# Altium project QAM16.PrjPcb (part 2 of 3)

## Sheet DAC.SchDoc
size A4; Organization: Rotronic AG; Address1: Grindelstrasse 6; Address2: 8303 Bassersdorf; Address3: Switzerland; DocumentNumber: 8; SheetNumber: 8; SheetTotal: 10; Web_Address: www.rotronic.ch; E_Mail_Address: *@rotronic.ch; Fon: +41 (0)44 838 11 11; Fax: +41 (0)44 836 44 24
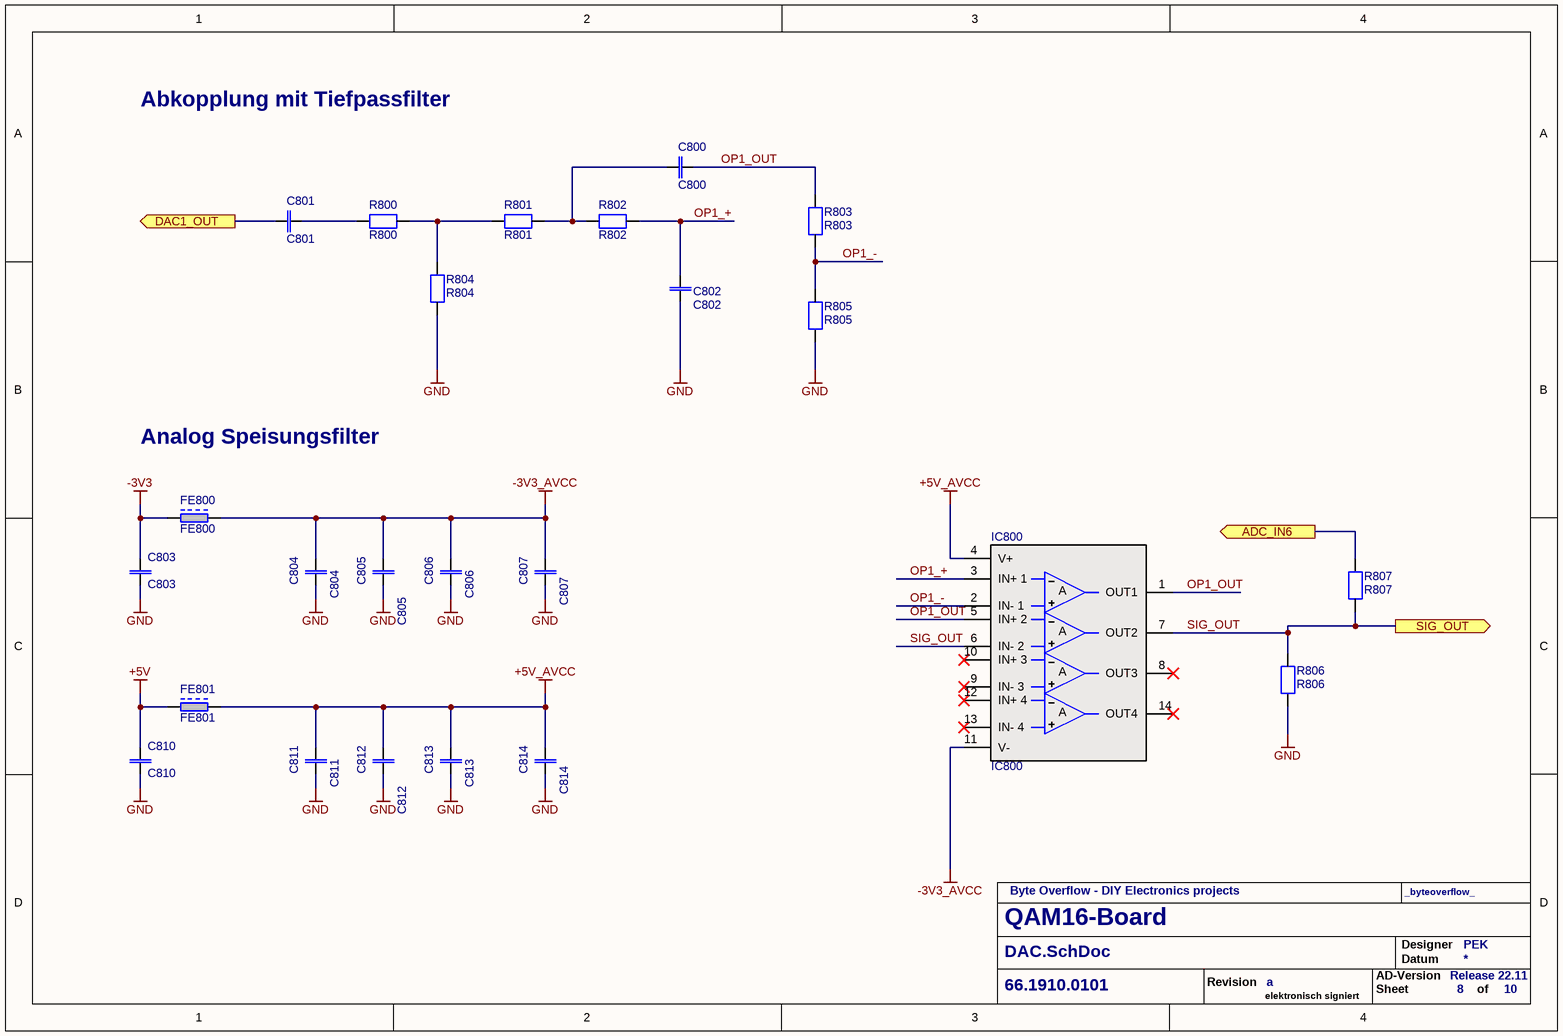
[diagram p5: DAC.SchDoc]

### Parts
C800  C800  [0603-1608]
C801  C801  [0805-2012]
C802  C802  [0603-1608]
C803  C803  [0402-1005]
C804  C804  [0805-2012]
C805  C805  [0603-1608]
C806  C806  [0805-2012]
C807  C807  [0603-1608]
C810  C810  [0402-1005]
C811  C811  [0805-2012]
C812  C812  [0603-1608]
C813  C813  [0805-2012]
C814  C814  [0603-1608]
FE800  FE800  [0603-1608]
FE801  FE801  [0603-1608]
IC800  IC800  [SOIC-14]
R800  R800  [0603-1608]
R801  R801  [0603-1608]
R802  R802  [0603-1608]
R803  R803  [0603-1608]
R804  R804  [0603-1608]
R805  R805  [0603-1608]
R806  R806  [0603-1608]
R807  R807  [0603-1608]

### Ports
ADC_IN6 (out), DAC1_OUT (out), SIG_OUT (out)

### Nets
+5V: C810.1 FE801.2
+5V_AVCC: C811.1 C812.1 C813.1 C814.1 FE801.1 IC800.4(V+)
-3V3: C803.1 FE800.2
-3V3_AVCC: C804.1 C805.1 C806.1 C807.1 FE800.1 IC800.11(V-)
GND: C802.1 C803.2 C804.2 C805.2 C806.2 C807.2 C810.2 C811.2 C812.2 C813.2 C814.2 R804.2 R805.1 R806.1
ADC_IN6: R807.1 ; port ADC_IN6
DAC1_OUT: C801.1 ; port DAC1_OUT
OP1_+: C802.2 IC800.3(IN+_1) R802.2
OP1_-: IC800.2(IN-_1) R803.2 R805.2
OP1_OUT: C800.2 IC800.1(OUT1) IC800.5(IN+_2) R803.1
SIG_OUT: IC800.6(IN-_2) IC800.7(OUT2) R806.2 R807.2 ; port SIG_OUT
NetC800_1: C800.1 R801.2 R802.1
NetC801_2: C801.2 R800.1
NetR800_2: R800.2 R801.1 R804.1

Not connected (* = marked no-connect by the designer): IC800 8(OUT3)* 9(IN-_3)* 10(IN+_3)* 12(IN+_4)* 13(IN-_4)* 14(OUT4)*

### Notes on the sheet
- Abkopplung mit Tiefpassfilter
- Analog Speisungsfilter
- Byte Overflow - DIY Electronics projects
- _byteoverflow_
- Revision
- AD-Version
- Designer
- Datum
- elektronisch signiert
- Sheet
- of
- (in symbol I0016) A

### Library data of the parts
C800 C802 = F0058: Capacitor; Part-Number: 63.0224.1400; Manufacturer: KEMET; Manufacturer Part Number: C0603C224K4RAC7867; Designator: C 220nF 16V; ID: F0058; Operating Range: -55°C to +85°C; Note: 220nF X5R 16V 10% Taiyo Yuden EMK107BJ224KAHT; Specification: 19.09.2011 MLP; Verification: 05.07.2012 OPT; Value: 220nF 16V; Component Type: Standard; ComponentLink1Description: http://www.kemet.com/docfinder?Partnumber=C0603C224K4RACTU; ComponentLink1URL: http://www.kemet.com/docfinder?Partnumber=C0603C224K4RACTU; Status: Active; Availability Date: 15.11.2016 OPT; RoHS compliant: Yes; Flammability: n.a.; Pin Count: 2; Price 100: 0.02; Price 1000: 0.02; Price Date: 02.12.2019 Pro Alpha; Changed: 19.09.2011 MLP; Price: 0.02; Supplier 1: Digi-Key; Supplier Part Number 1: 399-5619-1-ND; Part Status: Active; RoHS: RoHS Compliant
C801 C804 C806 C811 C813 = F0127: Capacitor; Part-Number: 63.0105.1500; Manufacturer: Murata Electronics North America; Manufacturer Part Number: GRM21BF51H105ZA12L; ID: F0127; Operating Range: -30°C to +85°C; Note: 1uF 50V Y5V 20% Murata GRM21BF51H105ZA12L; Specification: 27.12.2012 OPT; Value: 1uF 50V; Designator: C 1uF 50V; Component Type: Standard; Status: Active; Availability Date: 15.11.2016 OPT; RoHS compliant: Yes; Flammability: n.a.; Pin Count: 2; Price 100: 0.067; Price 1000: 0.067; Price Date: 02.12.2019 Pro Alpha; Changed: 27.12.2012 OPT; Price: 0.118; Supplier 1: Digi-Key; Supplier Part Number 1: 490-3903-1-ND; Part Status: Discontinued at Digi-Key; RoHS: RoHS Compliant; ComponentLink1Description: Datasheet; ComponentLink1URL: http://www.murata.com/products/catalog/pdf/c02e.pdf; ComponentLink2Description: http://search.murata.co.jp/Ceramy/image/img/A01X/G101/ENG/GRM21BF51H105ZA12-01.pdf; ComponentLink2URL: http://search.murata.co.jp/Ceramy/image/img/A01X/G101/ENG/GRM21BF51H105ZA12-01.pdf
C803 C810 = F0092: Capacitor; Part-Number: 63.7000.0030; Manufacturer: Taiyo Yuden; Manufacturer Part Number: JMK105BBJ475MV-F; Designator: C 4.7uF 6.3V; ID: F0092; Operating Range: -55°C to +85°C; Note: 4.7uF X5R 6.3V 20% Taiyo Yuden JMK105BBJ475MV-F; Specification: 19.09.2011 MLP; Verification: 05.07.2012 OPT; Value: 4.7uF 6.3V; Component Type: Standard; ComponentLink1Description: http://ds.yuden.co.jp/TYCOMPAS/ut/detail.do?productNo=JMK105BBJ475MV-F&fileName=JMK105BBJ475MV-F_SS&mode=specSheetDownload; ComponentLink1URL: http://ds.yuden.co.jp/TYCOMPAS/ut/detail.do?productNo=JMK105BBJ475MV-F&fileName=JMK105BBJ475MV-F_SS&mode=specSheetDownload; Status: Active; Availability Date: 15.11.2016 OPT; RoHS compliant: Yes; Flammability: n.a.; Pin Count: 2; Price 100: 0.057; Price 1000: 0.057; Price Date: 02.12.2019 Pro Alpha; Changed: 19.09.2011 MLP; Price: 0.012; Supplier Part Number 1: 587-2787-1-ND; Part Status: Active; RoHS: RoHS Compliant; Supplier 1: Digi-Key
C805 C807 C812 C814 = F0161: Capacitor; Part-Number: 63.0104.1450; Manufacturer: KEMET; Manufacturer Part Number: C0603C104K5RACTU; ID: F0161; Operating Range: -55°C to +125°C; Note: 100nF 50V X7R 10% Kemet C0603C104K5RACTU; Specification: 05.09.2013 OPT; Value: 100nF 50V; Designator: C 100nF 50V X7R; Component Type: Standard; ComponentLink1Description: Datasheet; ComponentLink1URL: http://www.kemet.com/kemet/web/homepage/kechome.nsf/vapubfiles/KEM_C1002_X7R_SMD.pdf/$file/KEM_C1002_X7R_SMD.pdf; Pin Count: 2; Price 100: 0.007; Price 1000: 0.007; Price Date: 02.12.2019 Pro Alpha; Changed: 05.09.2013 OPT; Price: 0.01; Availability Date: 15.11.2016 OPT; Flammability: n.a.; RoHS compliant: Yes; Status: Active; Part Status: Active; RoHS: RoHS Compliant; Supplier Part Number 1: 399-5089-1-ND; Supplier 1: Digi-Key
FE800 FE801 = M0071: Ferrite; Part-Number: 69.1810.2000; Manufacturer: Murata Electronics North America; ID: M0071; Operating Range: -55°C to +125°C; Note: Murata BLM18AG102SN1D Ferrit 1000Ohm 400mA; Specification: 21.09.2016 OPT; Value: BLM18AG102SN1D; Component Type: Standard; Pin Count: 2; Price Date: 02.12.2019 Pro Alpha; Changed: 21.09.2016 OPT; Price: 0.021; ComponentLink1Description: Datasheet; ComponentLink1URL: http://search.murata.co.jp/Ceramy/image/img/PDF/ENG/L0110S0100BLM18A.pdf; Price 100: 0.035; Price 1000: 0.026; Availability Date: 21.09.2016 OPT; Flammability: n.a.; RoHS compliant: Yes; Status: Active; Manufacturer Part Number: BLM18AG102SN1D; Part Status: Active; RoHS: RoHS Compliant; Supplier Part Number 1: 490-1015-1-ND; Supplier 1: Digi-Key; Designator: BLM18AG102SN1D
IC800 = I0016: OPAMP; Part-Number: 00.0000.0000; Manufacturer: Texas Instruments; Designator: LMC6484IMX/NOPB; ID: I0016; Operating Range: -40°C to +125°C; Note: Operationsverstärker CMOS QUAD Rail to Rail; Changed: 19.09.2020 PEK; Value: LMC6484IMX/NOPB; Component Type: Standard; ComponentLink1Description: Datasheet; ComponentLink1URL: https://www.ti.com/lit/ds/symlink/lmc6484.pdf?ts=1600470487572&ref_url=https%253A%252F%252Fwww.ti.com%252Fstore%252Fti%252Fen%252Fp%252Fproduct%252F%253Fp%253DLMC6484IMX%252FNOPB; Status: Active; Availability Date: 19.09.2020 PEK; RoHS compliant: Yes; Flammability: n.a.; Pin Count: 14; Price 100: 1.52; Price 1000: 1.03; Price Date: 19.09.2020 PEK; Specification: 19.09.2020 PEK; Price: 2.25; Supplier 1: Mouser; Supplier Part Number 1: LMC6484IMX/NOPB; Manufacturer Part Number: LMC6484IMX/NOPB; Part Status: Active; RoHS: RoHS Compliant
R800 = Q0174: Resistor; Part-Number: 71.5602.1300; Manufacturer: Vishay Dale; Manufacturer Part Number: CRCW060356K0FKEA; Designator: R 56k 1%; ID: Q0174; Note: 56k 1% 100ppm 1/10W Vishay CRCW060356K0FKEA; Changed: 19.09.2011 MLP; Verification: 05.07.2012 OPT; Value: 56k 1%; Component Type: Standard; ComponentLink1Description: http://www.vishay.com/docs/20035/dcrcwe3.pdf; ComponentLink1URL: http://www.vishay.com/docs/20035/dcrcwe3.pdf; Operating Range: -; Status: Active; Availability Date: 16.11.2016 OPT; RoHS compliant: Yes; Flammability: n.a.; Pin Count: 2; Price 100: 0.002; Price 1000: 0.002; Price Date: 02.12.2019 Pro Alpha; Specification: 19.09.2011 MLP; Price: 0.002; Supplier: Digi-Key; Supplier Part Number: 541-56.0KHCT-ND; Part Status: Active; RoHS: RoHS Compliant
R801 R802 R805-R807 = Q0017: Resistor; Part-Number: 71.1002.1300; Manufacturer: Vishay Dale; Manufacturer Part Number: CRCW060310K0FKEAHP; Designator: R 10k 1%; ID: Q0017; Operating Range: -55°C to +155°C; Note: 10k 1% 100ppm 1/10W Vishay CRCW060310K0FKEA; Changed: 19.09.2011 MLP; Verification: 05.07.2012 OPT; Value: 10k; Component Type: Standard; ComponentLink1Description: http://www.vishay.com/docs/20043/crcwhpe3.pdf; ComponentLink1URL: http://www.vishay.com/docs/20043/crcwhpe3.pdf; Status: Active; Availability Date: 16.11.2016 OPT; RoHS compliant: Yes; Flammability: n.a.; Pin Count: 2; Price 100: 0.002; Price 1000: 0.002; Price Date: 02.12.2019 Pro Alpha; Specification: 19.09.2011 MLP; Price: 0.001; Supplier: Digi-Key; Supplier Part Number: 541-10.0KSCT-ND; Part Status: Active; RoHS: RoHS Compliant
R803 = Q0180: Resistor; Part-Number: 71.6801.1300; Manufacturer: Vishay Dale; Manufacturer Part Number: CRCW06036K80FKEA; Designator: R 6.8k 1%; ID: Q0180; Operating Range: -55°C to +155°C; Note: 6.8k 1% 100ppm 1/10W Vishay CRCW06036K80FKEA; Changed: 19.09.2011 MLP; Verification: 05.07.2012 OPT; Value: 6.8k 1%; Component Type: Standard; ComponentLink1Description: http://www.vishay.com/docs/20035/dcrcwe3.pdf; ComponentLink1URL: http://www.vishay.com/docs/20035/dcrcwe3.pdf; Status: Active; Availability Date: 16.11.2016 OPT; RoHS compliant: Yes; Flammability: n.a.; Pin Count: 2; Price 100: 0.002; Price 1000: 0.002; Price Date: 02.12.2019 Pro Alpha; Specification: 19.09.2011 MLP; Price: 0.002; Supplier: Digi-Key; Supplier Part Number: 541-6.80KHCT-ND; Part Status: Active; RoHS: RoHS Compliant
R804 = Q0073: Resistor; Part-Number: 71.1802.1300; Manufacturer: Vishay Dale; Manufacturer Part Number: CRCW060318K0FKEA; Designator: R 18k 1%; ID: Q0073; Operating Range: -55°C to +155°C; Note: 18k 1% 100ppm 1/10W Vishay CRCW060318K0FKTA; Changed: 19.09.2011 MLP; Verification: 05.07.2012 OPT; Value: 18k 1%; Component Type: Standard; ComponentLink1Description: http://www.vishay.com/docs/20035/dcrcwe3.pdf; ComponentLink1URL: http://www.vishay.com/docs/20035/dcrcwe3.pdf; Status: Active; Availability Date: 16.11.2016 OPT; RoHS compliant: Yes; Flammability: n.a.; Pin Count: 2; Price 100: 0.002; Price 1000: 0.002; Price Date: 02.12.2019 Pro Alpha; Specification: 19.09.2011 MLP; Price: 0.002; Supplier: Digi-Key; Supplier Part Number: 541-18.0KHDKR-ND; Part Status: Active; RoHS: RoHS Compliant

## Sheet Display.SchDoc
size A4; Organization: Rotronic AG; Address1: Grindelstrasse 6; Address2: 8303 Bassersdorf; Address3: Switzerland; DocumentNumber: 4; SheetNumber: 4; SheetTotal: 10; Web_Address: www.rotronic.ch; E_Mail_Address: *@rotronic.ch; Fon: +41 (0)44 838 11 11; Fax: +41 (0)44 836 44 24
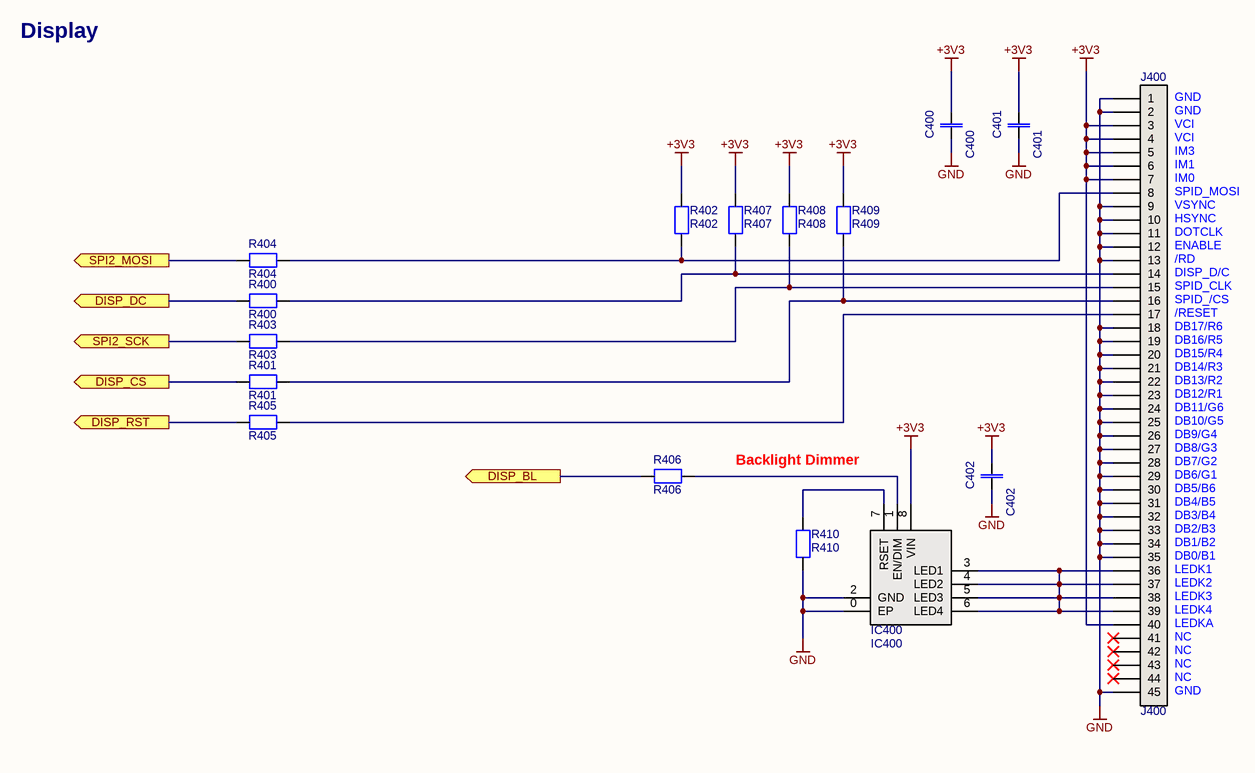
[diagram p6: Display.SchDoc]

### Parts
C400  C400  [0805-2012]
C401  C401  [0603-1608]
C402  C402  [0603-1608]
IC400  IC400  [UDFN-8 517AW-01]
J400  J400  [SAMTEC_ZF5S-45-01-T-WT]
R400  R400  [0603-1608]
R401  R401  [0603-1608]
R402  R402  [0603-1608]
R403  R403  [0603-1608]
R404  R404  [0603-1608]
R405  R405  [0603-1608]
R406  R406  [0603-1608]
R407  R407  [0603-1608]
R408  R408  [0603-1608]
R409  R409  [0603-1608]
R410  R410  [0603-1608]

### Ports
DISP_BL (out), DISP_CS (out), DISP_DC (out), DISP_RST (out), SPI2_MOSI (out), SPI2_SCK (out)

### Nets
+3V3: C400.1 C401.1 C402.1 IC400.8(VIN) J400.3 J400.4 J400.5 J400.6 J400.7 J400.40 R402.2 R407.2 R408.2 R409.2
GND: C400.2 C401.2 C402.2 IC400.0(EP) IC400.2(GND) J400.1 J400.2 J400.9 J400.10 J400.11 J400.12 J400.13 J400.18 J400.19 J400.20 J400.21 J400.22 J400.23 J400.24 J400.25 J400.26 J400.27 J400.28 J400.29 J400.30 J400.31 J400.32 J400.33 J400.34 J400.35 J400.45 R410.2
DISP_BL: R406.2 ; port DISP_BL
DISP_CS: R401.2 ; port DISP_CS
DISP_DC: R400.2 ; port DISP_DC
DISP_RST: R405.2 ; port DISP_RST
SPI2_MOSI: R404.2 ; port SPI2_MOSI
SPI2_SCK: R403.2 ; port SPI2_SCK
NetIC400_1: IC400.1(EN/DIM) R406.1
NetIC400_3: IC400.3(LED1) IC400.4(LED2) IC400.5(LED3) IC400.6(LED4) J400.36 J400.37 J400.38 J400.39
NetIC400_7: IC400.7(RSET) R410.1
NetJ400_8: J400.8 R402.1 R404.1
NetJ400_14: J400.14 R400.1 R407.1
NetJ400_15: J400.15 R403.1 R408.1
NetJ400_16: J400.16 R401.1 R409.1
NetJ400_17: J400.17 R405.1

Not connected (* = marked no-connect by the designer): J400 41* 42* 43* 44*

### Notes on the sheet
- Display
- (near J400) GND
- (near J400) VCI
- (near J400) IM3
- (near J400) IM1
- (near J400) IM0
- (near J400) SPID_MOSI
- (near J400) VSYNC
- (near J400) HSYNC
- (near J400) DOTCLK
- (near J400) ENABLE
- (near J400) /RD
- (near J400) DISP_D/C
- (near J400) /RESET
- (near J400) SPID_/CS
- (near J400) SPID_CLK
- (near J400) DB17/R6
- (near J400) DB16/R5
- (near J400) DB15/R4
- (near J400) DB14/R3
- (near J400) DB13/R2
- (near J400) DB12/R1
- (near J400) DB11/G6
- (near J400) DB8/G3
- (near J400) DB9/G4
- (near J400) DB10/G5
- Backlight Dimmer
- (near J400) DB4/B5
- (near J400) DB5/B6
- (near J400) DB6/G1
- (near J400) DB7/G2
- (near J400) DB0/B1
- (near J400) DB1/B2
- (near J400) DB2/B3
- (near J400) DB3/B4
- (near J400) LEDK1
- (near J400) LEDK2
- (near J400) LEDK3
- (near J400) LEDK4
- (near J400) LEDKA
- (near J400) NC
- Byte Overflow - DIY Electronics projects
- _byteoverflow_
- Revision
- AD-Version
- Designer
- Datum
- elektronisch signiert
- Sheet
- of

### Library data of the parts
C400 = F0127: Capacitor; Part-Number: 63.0105.1500; Manufacturer: Murata Electronics North America; Manufacturer Part Number: GRM21BF51H105ZA12L; Designator: C 1uF 50V; ID: F0127; Operating Range: -30°C to +85°C; Note: 1uF 50V Y5V 20% Murata GRM21BF51H105ZA12L; Specification: 27.12.2012 OPT; Value: 1uF 50V; Component Type: Standard; ComponentLink1Description: Datasheet; ComponentLink1URL: http://www.murata.com/products/catalog/pdf/c02e.pdf; Status: Active; Availability Date: 15.11.2016 OPT; RoHS compliant: Yes; Flammability: n.a.; ComponentLink2Description: http://search.murata.co.jp/Ceramy/image/img/A01X/G101/ENG/GRM21BF51H105ZA12-01.pdf; ComponentLink2URL: http://search.murata.co.jp/Ceramy/image/img/A01X/G101/ENG/GRM21BF51H105ZA12-01.pdf; Pin Count: 2; Price 100: 0.067; Price 1000: 0.067; Price Date: 02.12.2019 Pro Alpha; Changed: 27.12.2012 OPT; Price: 0.118; Supplier Part Number 1: 490-3903-1-ND; Part Status: Discontinued at Digi-Key; RoHS: RoHS Compliant; Supplier 1: Digi-Key
C401 C402 = F0161: as C805 on sheet DAC; Component Type: Standard; ComponentLink1Description: Datasheet; ComponentLink1URL: http://www.kemet.com/kemet/web/homepage/kechome.nsf/vapubfiles/KEM_C1002_X7R_SMD.pdf/$file/KEM_C1002_X7R_SMD.pdf; Status: Active; Availability Date: 15.11.2016 OPT; RoHS compliant: Yes; Flammability: n.a.; Pin Count: 2; Price 100: 0.007; Price 1000: 0.007; Price Date: 02.12.2019 Pro Alpha; Changed: 05.09.2013 OPT; Price: 0.01; Supplier Part Number 1: 399-5089-1-ND; Part Status: Active; RoHS: RoHS Compliant; Supplier 1: Digi-Key
IC400 = E0058: Driver; Part-Number: 61.4004.2300; Manufacturer: ON Semiconductor; Designator: CAT4004AHU2-GT3; ID: E0058; Operating Range: -40°C to +125°C; Note: ON Semiconductor CAT4004AHU2-GT3 LED-Beleuchtungstreiber LED DR 4 CH EZ DIM I/F; Specification: 13.09.2013 OPT; Verification: 18.09.2014 FUW; Value: CAT4004AHU2-GT3; Component Type: Standard; ComponentLink1Description: Datasheet; ComponentLink1URL: http://www.onsemi.com/pub_link/Collateral/CAT4004A-D.PDF; Status: Active; Availability Date: 15.11.2016 OPT; RoHS compliant: Yes; Flammability: n.a.; Pin Count: 8; Price 100: 0.624; Price 1000: 0.436; Price Date: 02.12.2019 Pro Alpha; Changed: 13.09.2013 OPT; Price: 0.591; Supplier Part Number 1: CAT4004AHU2-GT3OSCT-ND; Manufacturer Part Number: CAT4004AHU2-GT3; Part Status: Active; RoHS: RoHS Compliant; Supplier 1: Digi-Key
J400 = N0180: Connector; Part-Number: 00.0000.0000; Designator: FFC 45 Pos F32Q-1A7H1-11045; ID: N0180; Operating Range: -40°C to +120°C; Note: FFC & FPC-Steckverbinder F31W-1A7H1-11024-Slider type; Specification: 02.04.2022 PEK; Value: FFC 45 Pos F32Q-1A7H1-11045; Component Type: Standard; ComponentLink1Description: Datasheet; ComponentLink1URL: https://cdn.amphenol-cs.com/media/wysiwyg/files/documentation/datasheet/flex/ffc_fpc_050mm_f32r_f32q.pdf; Status: Active; Availability Date: 02.04.2022 PEK; RoHS compliant: Yes; Flammability: UL 94 V-0; Pin Count: 45; Price 100: 1.11; Price 1000: 1.11; Price Date: 02.04.2022 PEK; Changed: 02.04.2022 PEK; Price: 1.11
R400 R401 R403-R406 = Q0011: Resistor; Part-Number: 71.1000.1300; Manufacturer: Vishay Dale; Manufacturer Part Number: CRCW0603100RFKEA; Designator: R 100E 1%; ID: Q0011; Operating Range: -55°C to +155°C; Note: 100E 1% 100ppm 1/10W Vishay / Dale CRCW0603100RFKTB; Changed: 19.09.2011 MLP; Verification: 05.07.2012 OPT; Value: 100E 1%; Component Type: Standard; ComponentLink1Description: http://www.vishay.com/docs/20035/dcrcwe3.pdf; ComponentLink1URL: http://www.vishay.com/docs/20035/dcrcwe3.pdf; Status: Active; Availability Date: 16.11.2016 OPT; RoHS compliant: Yes; Flammability: n.a.; Pin Count: 2; Price 100: 0.002; Price 1000: 0.002; Price Date: 02.12.2019 Pro Alpha; Specification: 19.09.2011 MLP; Price: 0.002; Supplier: Digi-Key; Supplier Part Number: 541-100HCT-ND; Part Status: Active; RoHS: RoHS Compliant
R402 R407-R409 = Q0017: Resistor; Part-Number: 71.1002.1300; Manufacturer: Vishay Dale; Manufacturer Part Number: CRCW060310K0FKEAHP; ID: Q0017; Operating Range: -55°C to +155°C; Note: 10k 1% 100ppm 1/10W Vishay CRCW060310K0FKEA; Changed: 19.09.2011 MLP; Verification: 05.07.2012 OPT; Value: 10k; Designator: R 10k 1%; Component Type: Standard; ComponentLink1Description: http://www.vishay.com/docs/20043/crcwhpe3.pdf; ComponentLink1URL: http://www.vishay.com/docs/20043/crcwhpe3.pdf; Status: Active; Availability Date: 16.11.2016 OPT; RoHS compliant: Yes; Flammability: n.a.; Pin Count: 2; Price 100: 0.002; Price 1000: 0.002; Price Date: 02.12.2019 Pro Alpha; Specification: 19.09.2011 MLP; Price: 0.001; Supplier: Digi-Key; Supplier Part Number: 541-10.0KSCT-ND; Part Status: Active; RoHS: RoHS Compliant
R410 = Q0140: Resistor; Part-Number: 71.3901.1300; Manufacturer: Vishay Dale; Manufacturer Part Number: CRCW06033K90FKEA; Designator: R 3.9k 1%; ID: Q0140; Note: 3.9k 1% 100ppm 1/10W Vishay CRCW06033K90FKEA; Changed: 19.09.2011 MLP; Verification: 05.07.2012 OPT; Value: 3.9k 1%; Component Type: Standard; Operating Range: -; Status: Active; Availability Date: 16.11.2016 OPT; RoHS compliant: Yes; Flammability: n.a.; Pin Count: 2; Price 100: 0.002; Price 1000: 0.002; Price Date: 02.12.2019 Pro Alpha; Specification: 19.09.2011 MLP; Price: 0.002; Supplier: Digi-Key; Supplier Part Number: 541-3.90KHCT-ND; Part Status: Active; RoHS: RoHS Compliant

## Sheet Sensors.SchDoc
size A4; Organization: Rotronic AG; Address1: Grindelstrasse 6; Address2: 8303 Bassersdorf; Address3: Switzerland; DocumentNumber: 5; SheetNumber: 5; SheetTotal: 10; Web_Address: www.rotronic.ch; E_Mail_Address: *@rotronic.ch; Fon: +41 (0)44 838 11 11; Fax: +41 (0)44 836 44 24
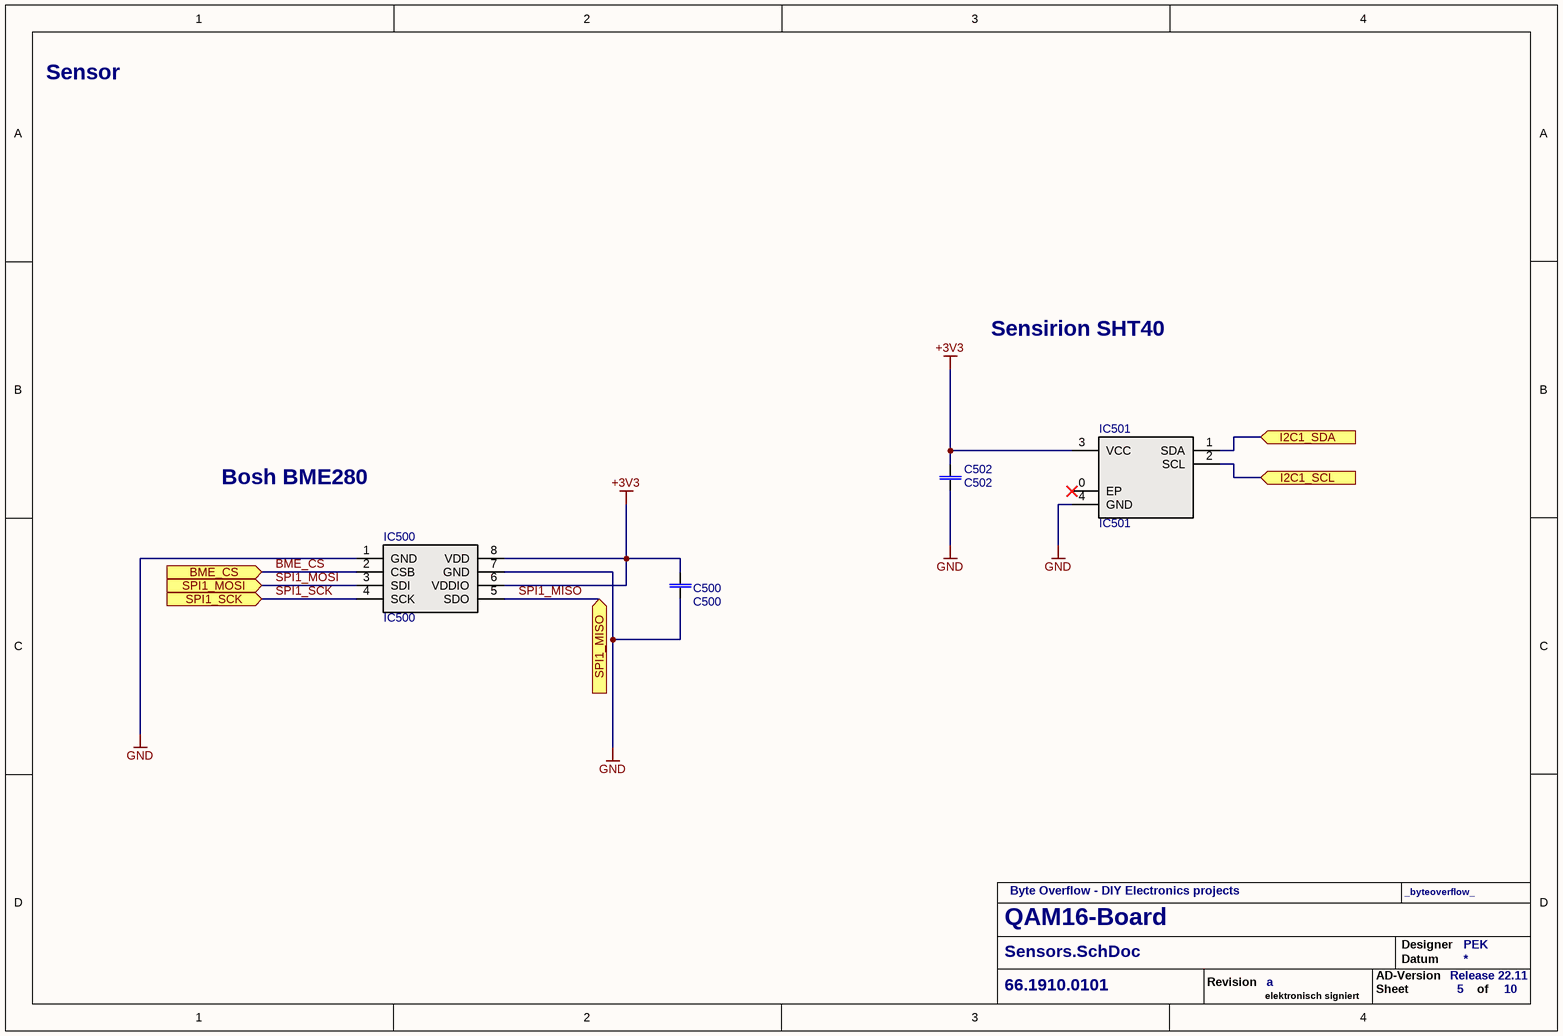
[diagram p7: Sensors.SchDoc]

### Parts
C500  C500  [0603-1608]
C502  C502  [0603-1608]
IC500  IC500  [LGA-8 2.5x2.5x0.95]
IC501  IC501  [XDCR_SHT40-AD1B-R2]

### Ports
BME_CS (in), I2C1_SCL (in), I2C1_SDA (in), SPI1_MISO (in), SPI1_MOSI (in), SPI1_SCK (in)

### Nets
+3V3: C500.1 C502.1 IC500.6(VDDIO) IC500.8(VDD) IC501.3(VCC)
GND: C500.2 C502.2 IC500.1(GND) IC500.7(GND) IC501.4(GND)
BME_CS: IC500.2(CSB) ; port BME_CS
I2C1_SCL: IC501.2(SCL) ; port I2C1_SCL
I2C1_SDA: IC501.1(SDA) ; port I2C1_SDA
SPI1_MISO: IC500.5(SDO) ; port SPI1_MISO
SPI1_MOSI: IC500.3(SDI) ; port SPI1_MOSI
SPI1_SCK: IC500.4(SCK) ; port SPI1_SCK

Not connected (* = marked no-connect by the designer): IC501 0(EP)*

### Notes on the sheet
- Sensor
- Sensirion SHT40
- Bosh BME280
- Byte Overflow - DIY Electronics projects
- _byteoverflow_
- Revision
- AD-Version
- Designer
- Datum
- elektronisch signiert
- Sheet
- of

### Library data of the parts
C500 C502 = F0161: as C805 on sheet DAC; Component Type: Standard; Status: Active; Availability Date: 15.11.2016 OPT; RoHS compliant: Yes; Flammability: n.a.; Pin Count: 2; Price 100: 0.007; Price 1000: 0.007; Price Date: 02.12.2019 Pro Alpha; Changed: 05.09.2013 OPT; Price: 0.01; Supplier 1: Digi-Key; Supplier Part Number 1: 399-5089-1-ND; Part Status: Active; RoHS: RoHS Compliant; ComponentLink1Description: Datasheet; ComponentLink1URL: http://www.kemet.com/kemet/web/homepage/kechome.nsf/vapubfiles/KEM_C1002_X7R_SMD.pdf/$file/KEM_C1002_X7R_SMD.pdf
IC500 = E0109: Sensor; Part-Number: 61.0280.0499; Manufacturer: Bosch Sensortec; Designator: BME280; ID: E0109; Operating Range: -40°C to +85°C; Note: Bosch BME280 Digital Pressure/Humidity/Temperature Sensor; Specification: 05.04.2016 ENP; Value: BME280; Component Type: Standard; ComponentLink1Description: Datasheet; ComponentLink1URL: https://ae-bst.resource.bosch.com/media/_tech/media/datasheets/BST-BME280_DS001-11.pdf; Status: Active; Availability Date: 15.11.2016 OPT; RoHS compliant: Yes; Flammability: n.a.; Pin Count: 8; Price 100: 6.18; Price 1000: 5.35; Price Date: 02.12.2019 Pro Alpha; Changed: 05.04.2016 ENP; Price: 3.595; Supplier 1: Digi-Key; Supplier Part Number 1: 828-1063-1-ND; Manufacturer Part Number: BME280; Part Status: Active; RoHS: RoHS Compliant
IC501 = E0147: Sensor; Part-Number: 00.0000.0000; Manufacturer: Sensirion; Designator: SHT40-AD1B-R2; ID: E0147; Operating Range: -40°C to +85°C; Note: Feuchtigkeitssensoren für Plattenmontage RH/ T Sensor; Specification: 02.04.2021 PEK; Value: SHT40-AD1B-R2; Component Type: Standard; ComponentLink1Description: Datasheet; ComponentLink1URL: https://www.mouser.ch/datasheet/2/682/Datasheet_SHT4xA-3002605.pdf; Status: Active; Availability Date: 02.04.2021 PEK; RoHS compliant: Yes; Flammability: n.a; Pin Count: 5; Price 100: 1.68; Price 1000: 1.33; Price Date: 02.04.2021 PEK; Changed: 02.04.2021 PEK; Price: 2.87; Supplier 1: Mouser; Supplier Part Number 1: 403-SHT40-AD1B-R2; Manufacturer Part Number: SHT40-AD1B-R2; Part Status: Active; RoHS: RoHS Compliant

## Sheet MCU.SchDoc
size A3; Organization: Rotronic AG; Address1: Grindelstrasse 6; Address2: 8303 Bassersdorf; Address3: Switzerland; DocumentNumber: 2; SheetNumber: 2; SheetTotal: 10; Web_Address: www.rotronic.ch; E_Mail_Address: *@rotronic.ch; Fon: +41 (0)44 838 11 11; Fax: +41 (0)44 836 44 24
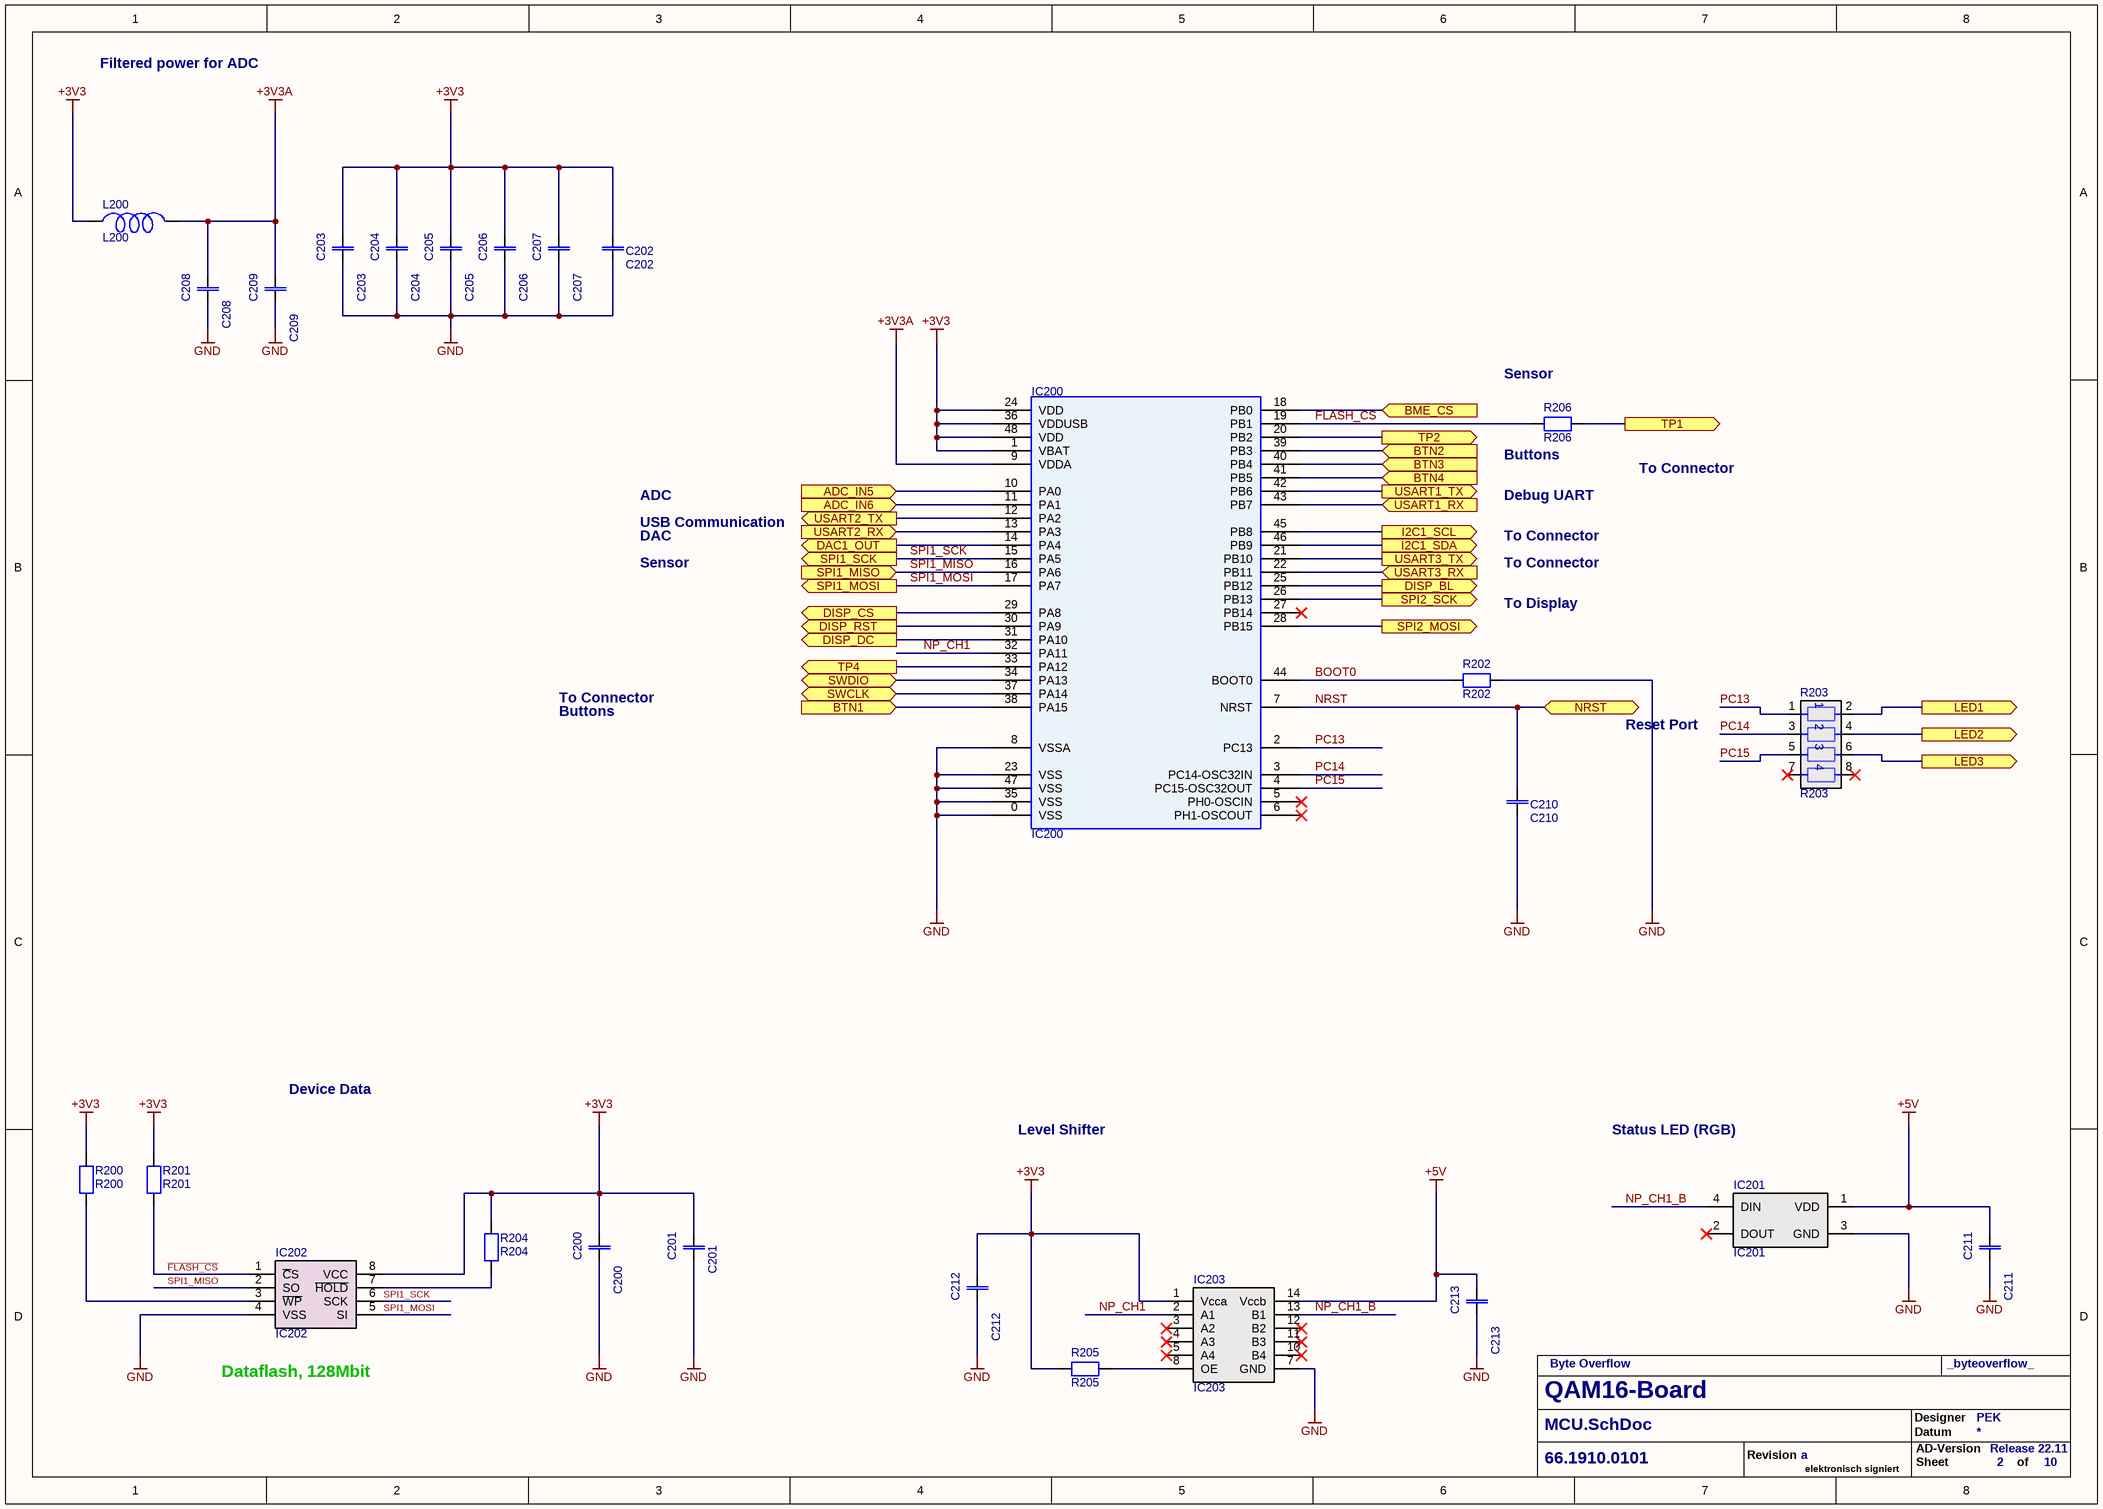
[diagram p8: MCU.SchDoc]

### Parts
C200  C200  [0603-1608]
C201  C201  [0805-2012]
C202  C202  [0603-1608]
C203  C203  [0603-1608]
C204  C204  [0603-1608]
C205  C205  [0603-1608]
C206  C206  [0603-1608]
C207  C207  [0603-1608]
C208  C208  [0805-2012]
C209  C209  [0603-1608]
C210  C210  [0603-1608]
C211  C211  [0603-1608]
C212  C212  [0603-1608]
C213  C213  [0603-1608]
IC200  IC200  [QFN48 7x7x0.9 WIZnet]
IC201  IC201  [LED_2812]
IC202  IC202  [SOIC-8]
IC203  IC203  [TSSOP14]
L200  L200  [0603-1608]
R200  R200  [0603-1608]
R201  R201  [0603-1608]
R202  R202  [0603-1608]
R203  R203  [Array-2010-4Way]
R204  R204  [0603-1608]
R205  R205  [0805-2012]
R206  R206  [0603-1608]

### Ports
ADC_IN5 (in), ADC_IN6 (in), BME_CS (in), BTN1 (in), BTN2 (in), BTN3 (in), BTN4 (in), DAC1_OUT (out), DISP_BL (out), DISP_CS (out), DISP_DC (out), DISP_RST (out), I2C1_SCL (out), I2C1_SDA (out), LED1 (out), LED2 (out), LED3 (out), NRST (bidir), SPI1_MISO (in), SPI1_MOSI (out), SPI1_SCK (out), SPI2_MOSI (out), SPI2_SCK (out), SWCLK (bidir), SWDIO (bidir), TP1 (out), TP2 (out), TP4 (out), USART1_RX (in), USART1_TX (out), USART2_RX (in), USART2_TX (out), USART3_RX (in), USART3_TX (out)

### Nets
+3V3: C200.1 C201.1 C202.1 C203.1 C204.1 C205.1 C206.1 C207.1 C212.1 IC200.1(VBAT) IC200.24(VDD) IC200.36(VDDUSB) IC200.48(VDD) IC202.8(VCC) IC203.1(Vcca) L200.1 R200.2 R201.2 R204.2 R205.1
+3V3A: C208.1 C209.1 IC200.9(VDDA) L200.2
+5V: C211.1 C213.1 IC201.1(VDD) IC203.14(Vccb)
GND: C200.2 C201.2 C202.2 C203.2 C204.2 C205.2 C206.2 C207.2 C208.2 C209.2 C210.2 C211.2 C212.2 C213.2 IC200.0(VSS) IC200.8(VSSA) IC200.23(VSS) IC200.35(VSS) IC200.47(VSS) IC201.3(GND) IC202.4(VSS) IC203.7(GND) R202.2
~{FLASH_CS}: IC200.19(PB1) IC202.1(~{C}S) R201.1 R206.1
ADC_IN5: IC200.10(PA0) ; port ADC_IN5
ADC_IN6: IC200.11(PA1) ; port ADC_IN6
BME_CS: IC200.18(PB0) ; port BME_CS
BOOT0: IC200.44(BOOT0) R202.1
BTN1: IC200.38(PA15) ; port BTN1
BTN2: IC200.39(PB3) ; port BTN2
BTN3: IC200.40(PB4) ; port BTN3
BTN4: IC200.41(PB5) ; port BTN4
DAC1_OUT: IC200.14(PA4) ; port DAC1_OUT
DISP_BL: IC200.25(PB12) ; port DISP_BL
DISP_CS: IC200.29(PA8) ; port DISP_CS
DISP_DC: IC200.31(PA10) ; port DISP_DC
DISP_RST: IC200.30(PA9) ; port DISP_RST
I2C1_SCL: IC200.45(PB8) ; port I2C1_SCL
I2C1_SDA: IC200.46(PB9) ; port I2C1_SDA
LED1: R203.2 ; port LED1
LED2: R203.4 ; port LED2
LED3: R203.6 ; port LED3
NP_CH1: IC200.32(PA11) IC203.2(A1)
NP_CH1_B: IC201.4(DIN) IC203.13(B1)
NRST: C210.1 IC200.7(NRST) ; port NRST
PC13: IC200.2(PC13) R203.1
PC14: IC200.3(PC14-OSC32IN) R203.3
PC15: IC200.4(PC15-OSC32OUT) R203.5
SPI1_MISO: IC200.16(PA6) IC202.2(SO) ; port SPI1_MISO
SPI1_MOSI: IC200.17(PA7) IC202.5(SI) ; port SPI1_MOSI
SPI1_SCK: IC200.15(PA5) IC202.6(SCK) ; port SPI1_SCK
SPI2_MOSI: IC200.28(PB15) ; port SPI2_MOSI
SPI2_SCK: IC200.26(PB13) ; port SPI2_SCK
SWCLK: IC200.37(PA14) ; port SWCLK
SWDIO: IC200.34(PA13) ; port SWDIO
TP1: R206.2 ; port TP1
TP2: IC200.20(PB2) ; port TP2
TP4: IC200.33(PA12) ; port TP4
USART1_RX: IC200.43(PB7) ; port USART1_RX
USART1_TX: IC200.42(PB6) ; port USART1_TX
USART2_RX: IC200.13(PA3) ; port USART2_RX
USART2_TX: IC200.12(PA2) ; port USART2_TX
USART3_RX: IC200.22(PB11) ; port USART3_RX
USART3_TX: IC200.21(PB10) ; port USART3_TX
NetIC202_3: IC202.3(~{WP}) R200.1
NetIC202_7: IC202.7(~{HOLD}) R204.1
NetIC203_8: IC203.8(OE) R205.2

Not connected (* = marked no-connect by the designer): IC200 5(PH0-OSCIN)* 6(PH1-OSCOUT)* 27(PB14)*; IC201 2(DOUT)*; IC203 3(A2)* 4(A3)* 5(A4)* 6(NC) 9(NC) 10(B4)* 11(B3)* 12(B2)*; R203 7* 8*

### Notes on the sheet
- Filtered power for ADC
- (near R206) Sensor
- ADC
- Debug UART
- (near R206) Buttons
- To Connector
- USB Communication
- Sensor
- DAC
- To Display
- Buttons
- Reset Port
- Device Data
- Level Shifter
- Status LED (RGB)
- (near IC202) Dataflash, 128Mbit
- Byte Overflow
- _byteoverflow_
- Revision
- Designer
- Datum
- AD-Version
- elektronisch signiert
- Sheet
- of

### Library data of the parts
C200 C210 = F0161: as C805 on sheet DAC; Component Type: Standard; ComponentLink1Description: Datasheet; ComponentLink1URL: http://www.kemet.com/kemet/web/homepage/kechome.nsf/vapubfiles/KEM_C1002_X7R_SMD.pdf/$file/KEM_C1002_X7R_SMD.pdf; Pin Count: 2; Price 100: 0.007; Price 1000: 0.007; Price Date: 02.12.2019 Pro Alpha; Changed: 05.09.2013 OPT; Price: 0.01; Availability Date: 15.11.2016 OPT; Flammability: n.a.; RoHS compliant: Yes; Status: Active; Part Status: Active; RoHS: RoHS Compliant; Supplier Part Number 1: 399-5089-1-ND; Supplier 1: Digi-Key
C201 C208 = F0127: as C801 on sheet DAC; Component Type: Standard; Pin Count: 2; Price 100: 0.067; Price 1000: 0.067; Price Date: 02.12.2019 Pro Alpha; Changed: 27.12.2012 OPT; Price: 0.118; Availability Date: 15.11.2016 OPT; Flammability: n.a.; RoHS compliant: Yes; Status: Active; ComponentLink1Description: Datasheet; ComponentLink1URL: http://www.murata.com/products/catalog/pdf/c02e.pdf; Part Status: Discontinued at Digi-Key; RoHS: RoHS Compliant; Supplier Part Number 1: 490-3903-1-ND; ComponentLink2Description: http://search.murata.co.jp/Ceramy/image/img/A01X/G101/ENG/GRM21BF51H105ZA12-01.pdf; ComponentLink2URL: http://search.murata.co.jp/Ceramy/image/img/A01X/G101/ENG/GRM21BF51H105ZA12-01.pdf; Supplier 1: Digi-Key
C202 = F0193: Capacitor; Part-Number: 63.7000.0032; Manufacturer: Murata Electronics North America; Manufacturer Part Number: GRM188R61E475ME11D; Designator: C 4.7uF 25V; ID: F0193; Operating Range: -55°C to +85°C; Note: 4.7uF 25V X5R 20% Murata Electronics GRM188R61E475ME11D; Specification: 02.09.2015 OPT; Value: 4.7uF 25V X5R; Component Type: Standard; ComponentLink1Description: Datasheet; ComponentLink1URL: http://search.murata.co.jp/Ceramy/image/img/A01X/partnumbering_e_01.pdf; Status: Active; Availability Date: 15.11.2016 OPT; RoHS compliant: Yes; Flammability: n.a.; ComponentLink2Description: http://search.murata.co.jp/Ceramy/image/img/A01X/G101/ENG/GRM188R61E475ME11-01.pdf; ComponentLink2URL: http://search.murata.co.jp/Ceramy/image/img/A01X/G101/ENG/GRM188R61E475ME11-01.pdf; Pin Count: 2; Price 100: 0.13; Price 1000: 0.11; Price Date: 02.12.2019 Pro Alpha; Changed: 02.09.2015 OPT; Price: 0.096; Supplier 1: Digi-Key; Supplier Part Number 1: GRM188R61E475ME11D-ND; Part Status: Active; RoHS: RoHS Compliant
C203-C207 C209 C211-C213 = F0161: Capacitor; Part-Number: 63.0104.1450; Manufacturer: KEMET; Manufacturer Part Number: C0603C104K5RACTU; Designator: C 100nF 50V X7R; ID: F0161; Operating Range: -55°C to +125°C; Note: 100nF 50V X7R 10% Kemet C0603C104K5RACTU; Specification: 05.09.2013 OPT; Value: 100nF 50V; Component Type: Standard; ComponentLink1Description: Datasheet; ComponentLink1URL: http://www.kemet.com/kemet/web/homepage/kechome.nsf/vapubfiles/KEM_C1002_X7R_SMD.pdf/$file/KEM_C1002_X7R_SMD.pdf; Status: Active; Availability Date: 15.11.2016 OPT; RoHS compliant: Yes; Flammability: n.a.; Pin Count: 2; Price 100: 0.007; Price 1000: 0.007; Price Date: 02.12.2019 Pro Alpha; Changed: 05.09.2013 OPT; Price: 0.01; Supplier 1: Digi-Key; Supplier Part Number 1: 399-5089-1-ND; Part Status: Active; RoHS: RoHS Compliant
IC200 = H0056: uC; Part-Number: 00.0000.0000; Manufacturer: STMicroelectronics; Designator: ST STM32L452CEU6; ID: H0056; Operating Range: -40°C to +85°C; Note: ARM Mikrocontroller - MCU STM32 Dyn Eff MCU 512 K 100 MHz CPU; Changed: 19.10.2022 PEK; Value: ST STM32L452CEU6; Component Type: Standard; ComponentLink1Description: Datasheet; ComponentLink1URL: https://www.st.com/resource/en/datasheet/stm32l452re.pdf; Status: Active; Availability Date: 19.10.2022 PEK; RoHS compliant: Yes; Flammability: n.a; Pin Count: 48; Price 100: 9.99; Price 1000: 9.99; Price Date: 19.10.2022 PEK; Specification: 19.10.2022 PEK; Price: 11.81; Supplier 1: Farnell; Manufacturer Part Number: STM32L452CEU6; Part Status: Active; RoHS: RoHS Compliant
IC201 = A0133: LED; Part-Number: 00.0000.0000; Manufacturer: China; ID: A0133; Operating Range: -40°C to +85°C; Note: Addressable RGB LED; Value: WS2812B; Specification: 14.11.2019 PEK; Designator: WS2812B; Component Type: Standard; ComponentLink1Description: Datasheet; ComponentLink1URL: https://cdn-shop.adafruit.com/datasheets/WS2812B.pdf; Status: Active; Availability Date: 14.11.2019 PEK; RoHS compliant: Yes; Flammability: n.a.; Pin Count: 4; Price 100: 0.4; Price 1000: 0.4; Verification: 14.11.2019 PEK; Changed: 14.11.2019 PEK; Price: 0.4; Price Date: 14.11.2019 PEK; Supplier: Aliexpress; Supplier Part Number: WS2812B; Manufacturer Part Number: WS2812B; Part Status: Active; RoHS: RoHS Compliant
IC202 = L0021: Memory; Part-Number: 00.0000.0000; Manufacturer: Microchip Technology; Designator: AT25M01-SHM-T; ID: L0021; Operating Range: -40°C to +85°C; Note: Atmel AT25M01-SHM-T SPI Serial EEPROM 1MBIT; Changed: 06.04.2016 OPT; Value: AT25M01-SHM-T; Component Type: Standard; ComponentLink1Description: Datasheet; ComponentLink1URL: http://www.atmel.com/images/atmel-8824-seeprom-at25m01-datasheet.pdf; Status: Active; Availability Date: 14.11.2016 OPT; RoHS compliant: Yes; Flammability: n.a.; Pin Count: 8; Price 100: 1.95; Price 1000: 1.75; Price Date: 06.04.2016 OPT; Specification: 06.04.2016 OPT; Price: 2.48; Supplier 1: Digi-Key; Supplier Part Number 1: AT25M01-SHM-TCT-ND; Manufacturer Part Number: AT25M01-SHM-T; Part Status: Discontinued at Digi-Key; RoHS: RoHS Compliant
IC203 = E0093: Level-shifter; Part-Number: 61.0104.9900; Manufacturer: Texas Instruments; ID: E0093; Operating Range: -40°C to +85°C; Note: Ti TXB0104PWR 4-Bit Bidirectional Voltage-level Translator With Automatic Direction Sensing; Specification: 06.08.2015 NEC; Value: TXB0104PWR; Designator: TXB0104; Component Type: Standard; ComponentLink1Description: Datasheet; ComponentLink1URL: http://www.ti.com/lit/ds/symlink/txb0104.pdf; Status: Active; Availability Date: 15.11.2016 OPT; RoHS compliant: Yes; Flammability: n.a.; Pin Count: 14; Price 100: 0.95; Price 1000: 0.55; Price Date: 02.12.2019 Pro Alpha; Changed: 06.08.2015 NEC; Price: 0.883; Supplier 1: Digi-Key; Supplier Part Number 1: 296-21929-1-ND; Manufacturer Part Number: TXB0104PWR; Part Status: Active; RoHS: RoHS Compliant
L200 = M0007: Inductor; Part-Number: 69.0220.0000; Manufacturer: Taiyo Yuden; Manufacturer Part Number: HK160822NJ-T; Designator: L 22nH; ID: M0007; Operating Range: -40°C to +85°C; Note: Taiyo Yuden HK160822NJ-T Festinduktoren INDCTR HIFREQ MLTLYR 0603 22nH 5%; Specification: 19.09.2011 MLP; Verification: 05.07.2012 OPT; Value: 22nH; Component Type: Standard; Status: Active; Availability Date: 15.11.2016 OPT; RoHS compliant: Yes; Flammability: n.a.; Pin Count: 2; Price 100: 0.076; Price 1000: 0.05; Price Date: 02.12.2019 Pro Alpha; Changed: 19.09.2011 MLP; Price: 0.029; Supplier 1: Digi-Key; Supplier Part Number 1: 587-1549-1-ND; Part Status: Active; RoHS: RoHS Compliant
R200 R201 R204 = Q0017: Resistor; Part-Number: 71.1002.1300; Manufacturer: Vishay Dale; Manufacturer Part Number: CRCW060310K0FKEAHP; ID: Q0017; Note: 10k 1% 100ppm 1/10W Vishay CRCW060310K0FKEA; Changed: 19.09.2011 MLP; Verification: 05.07.2012 OPT; Value: 10k; Operating Range: -55°C to +155°C; Designator: R 10k 1%; Component Type: Standard; Pin Count: 2; Price Date: 02.12.2019 Pro Alpha; Specification: 19.09.2011 MLP; Price: 0.001; Price 100: 0.002; Price 1000: 0.002; Availability Date: 16.11.2016 OPT; Flammability: n.a.; RoHS compliant: Yes; Status: Active; Part Status: Active; RoHS: RoHS Compliant; Supplier: Digi-Key; Supplier Part Number: 541-10.0KSCT-ND; ComponentLink1Description: http://www.vishay.com/docs/20043/crcwhpe3.pdf; ComponentLink1URL: http://www.vishay.com/docs/20043/crcwhpe3.pdf
R202 = Q0017: as R801 on sheet DAC; Component Type: Standard; ComponentLink1Description: http://www.vishay.com/docs/20043/crcwhpe3.pdf; ComponentLink1URL: http://www.vishay.com/docs/20043/crcwhpe3.pdf; Status: Active; Availability Date: 16.11.2016 OPT; RoHS compliant: Yes; Flammability: n.a.; Pin Count: 2; Price 100: 0.002; Price 1000: 0.002; Price Date: 02.12.2019 Pro Alpha; Specification: 19.09.2011 MLP; Price: 0.001; Supplier: Digi-Key; Supplier Part Number: 541-10.0KSCT-ND; Part Status: Active; RoHS: RoHS Compliant
R203 = Q0303: Resistor; Part-Number: 71.1000.1399; Manufacturer: Vishay Dale; Manufacturer Part Number: CRA04S083100RJTD; Designator: R 100E 4x 5.0%; ID: Q0303; Operating Range: -55°C to +150°C; Note: 100E 4x 5.0% 200ppm 1/16W Vishay CRA04S083100RJTD; Changed: 23.09.2014 OPT; Specification: 30.06.2014 OPT; Value: 100E 4x 5.0%; Component Type: Standard; ComponentLink1Description: Datasheet; ComponentLink1URL: http://www.mouser.com/ds/2/427/cra04s-103900.pdf; Status: Active; Availability Date: 16.11.2016 OPT; RoHS compliant: Yes; Flammability: n.a.; ComponentLink2Description: http://www.vishay.com/docs/31043/cra04s.pdf; ComponentLink2URL: http://www.vishay.com/docs/31043/cra04s.pdf; Pin Count: 2; Price 100: 0.077; Price 1000: 0.058; Price Date: 02.12.2019 Pro Alpha; Price: 0.025; Supplier: Digi-Key; Supplier Part Number: CRA4S8100CT-ND; Part Status: Active; RoHS: RoHS Compliant
R205 = Q0244: Resistor; Part-Number: 71.0000.0500; Manufacturer: Vishay Dale; Manufacturer Part Number: CRCW08050000Z0EAHP; Designator: R 0E 1%; ID: Q0244; Operating Range: -55°C to +155°C; Note: 0E 1.0% Vishay/Dale CRCW08050000Z0EA; Changed: 23.04.2013 OPT; Verification: 05.03.2013 ENP; Value: 0E 1%; Component Type: Standard; ComponentLink1Description: Datasheet; ComponentLink1URL: http://www.mouser.com/ds/2/427/dcrcwe3-109170.pdf; Status: Active; Availability Date: 16.11.2016 OPT; RoHS compliant: Yes; Flammability: n.a.; ComponentLink2Description: http://www.vishay.com/docs/20043/crcwhpe3.pdf; ComponentLink2URL: http://www.vishay.com/docs/20043/crcwhpe3.pdf; Pin Count: 2; Price 100: 0.007; Price 1000: 0.007; Price Date: 02.12.2019 Pro Alpha; Specification: 23.04.2013 OPT; Price: 0.005; Supplier: Digi-Key; Supplier Part Number: 541-0.0TBCT-ND; Part Status: Active; RoHS: RoHS Compliant
R206 = Q0011: as R400 on sheet Display; Component Type: Standard; ComponentLink1Description: http://www.vishay.com/docs/20035/dcrcwe3.pdf; ComponentLink1URL: http://www.vishay.com/docs/20035/dcrcwe3.pdf; Status: Active; Availability Date: 16.11.2016 OPT; RoHS compliant: Yes; Flammability: n.a.; Pin Count: 2; Price 100: 0.002; Price 1000: 0.002; Price Date: 02.12.2019 Pro Alpha; Specification: 19.09.2011 MLP; Price: 0.002; Supplier: Digi-Key; Supplier Part Number: 541-100HCT-ND; Part Status: Active; RoHS: RoHS Compliant

## Sheet Powersupply.SchDoc
size A4; Organization: Rotronic AG; Address1: Grindelstrasse 6; Address2: 8303 Bassersdorf; Address3: Switzerland; DocumentNumber: 10; SheetNumber: 10; SheetTotal: 10; Web_Address: www.rotronic.ch; E_Mail_Address: *@rotronic.ch; Fon: +41 (0)44 838 11 11; Fax: +41 (0)44 836 44 24
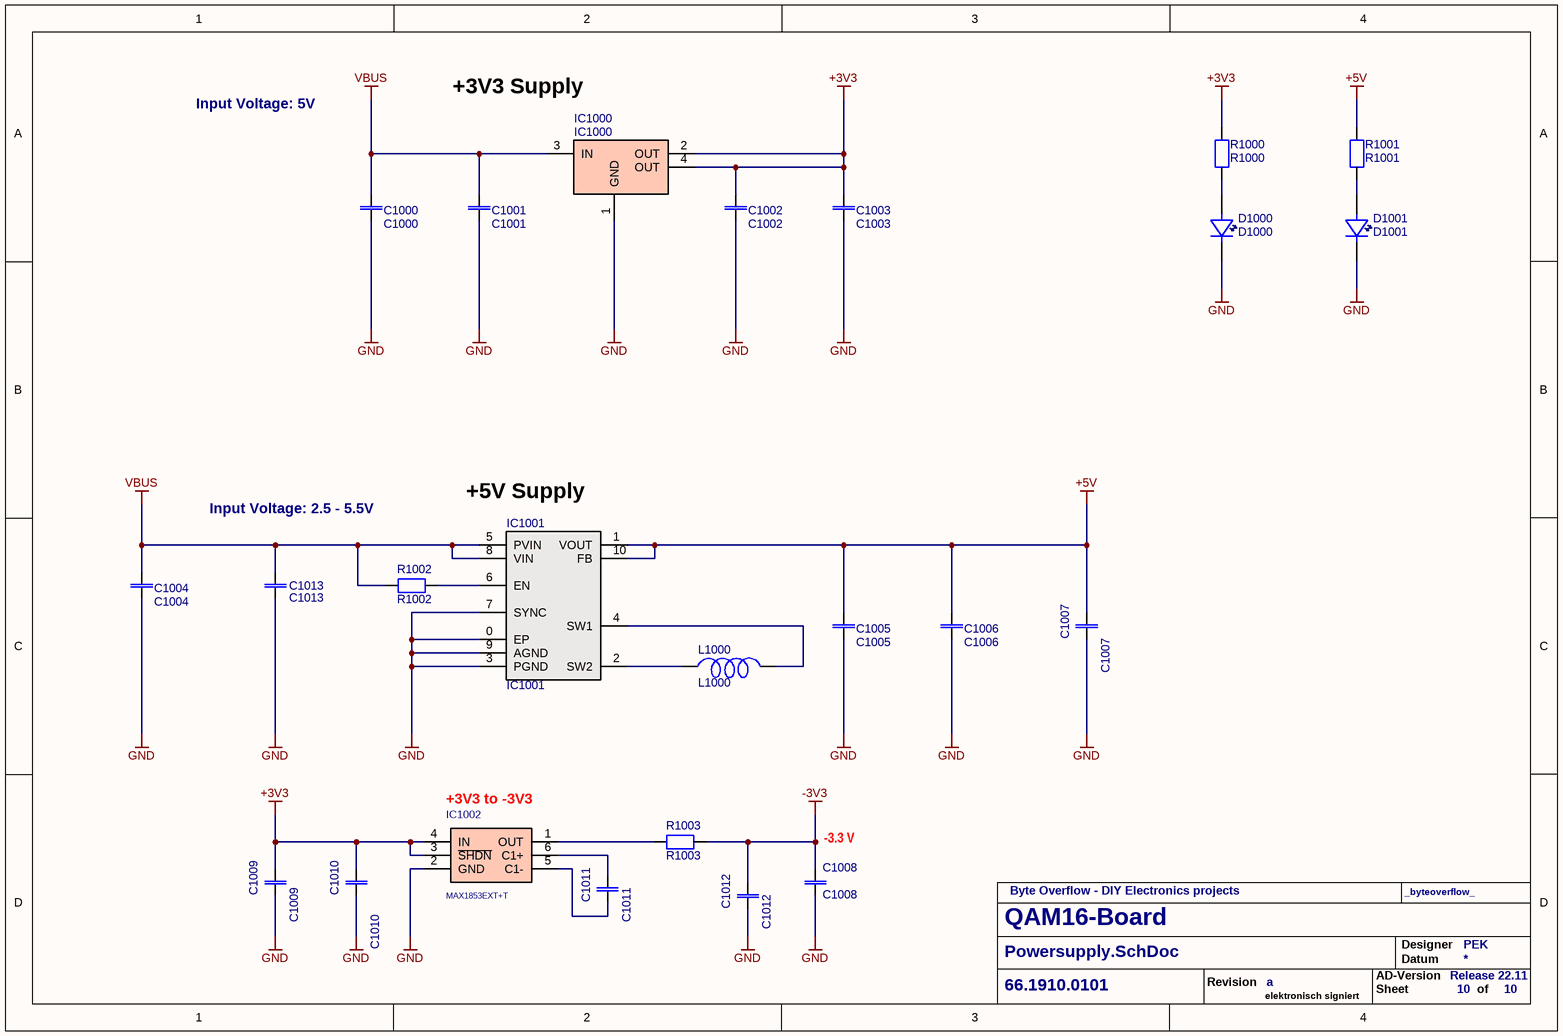
[diagram p9: Powersupply.SchDoc]

### Parts
C1000  C1000  [0805-2012]
C1001  C1001  [0805-2012]
C1002  C1002  [0805-2012]
C1003  C1003  [0805-2012]
C1004  C1004  [0805-2012]
C1005  C1005  [0805-2012]
C1006  C1006  [0805-2012]
C1007  C1007  [0805-2012]
C1008  C1008  [0805-2012]
C1009  C1009  [0402-1005]
C1010  C1010  [0805-2012]
C1011  C1011  [0402-1005]
C1012  C1012  [0402-1005]
C1013  C1013  [0805-2012]
D1000  D1000  [0805_LED]
D1001  D1001  [0805_LED]
IC1000  IC1000  [SOT-223]
IC1001  IC1001  [SON10]
IC1002  MAX1853EXT+T  [SC70-6]
L1000  L1000  [0805-2012]
R1000  R1000  [0805-2012]
R1001  R1001  [0805-2012]
R1002  R1002  [0805-2012]
R1003  R1003  [0603-1608]

### Nets
+3V3: C1002.1 C1003.1 C1009.1 C1010.1 IC1000.2(OUT) IC1000.4(OUT) IC1002.3(~{SHDN}) IC1002.4(IN) R1000.1
+5V: C1005.1 C1006.1 C1007.1 IC1001.1(VOUT) IC1001.10(FB) R1001.1
-3V3: C1008.1 C1012.1 R1003.2
GND: C1000.2 C1001.2 C1002.2 C1003.2 C1004.2 C1005.2 C1006.2 C1007.2 C1008.2 C1009.2 C1010.2 C1012.2 C1013.2 D1000.2(K) D1001.2(K) IC1000.1(GND) IC1001.0(EP) IC1001.3(PGND) IC1001.7(SYNC) IC1001.9(AGND) IC1002.2(GND)
VBUS: C1000.1 C1001.1 C1004.1 C1013.1 IC1000.3(IN) IC1001.5(PVIN) IC1001.8(VIN) R1002.1
NetC1011_1: C1011.1 IC1002.6(C1+)
NetC1011_2: C1011.2 IC1002.5(C1-)
NetD1000_1: D1000.1(A) R1000.2
NetD1001_1: D1001.1(A) R1001.2
NetIC1001_2: IC1001.2(SW2) L1000.1
NetIC1001_4: IC1001.4(SW1) L1000.2
NetIC1001_6: IC1001.6(EN) R1002.2
NetIC1002_1: IC1002.1(OUT) R1003.1

### Notes on the sheet
- Input Voltage: 5V
- +3V3 Supply
- Input Voltage: 2.5 - 5.5V
- (near IC1001) +5V Supply
- (near IC1002) +3V3 to -3V3
- (near C1008) -3.3 V
- Byte Overflow - DIY Electronics projects
- _byteoverflow_
- Revision
- AD-Version
- Designer
- Datum
- elektronisch signiert
- Sheet
- of

### Library data of the parts
C1000 C1002 = F0127: as C400 on sheet Display; Component Type: Standard; ComponentLink1Description: Datasheet; ComponentLink1URL: http://www.murata.com/products/catalog/pdf/c02e.pdf; Status: Active; Availability Date: 15.11.2016 OPT; RoHS compliant: Yes; Flammability: n.a.; ComponentLink2Description: http://search.murata.co.jp/Ceramy/image/img/A01X/G101/ENG/GRM21BF51H105ZA12-01.pdf; ComponentLink2URL: http://search.murata.co.jp/Ceramy/image/img/A01X/G101/ENG/GRM21BF51H105ZA12-01.pdf; Pin Count: 2; Price 100: 0.067; Price 1000: 0.067; Price Date: 02.12.2019 Pro Alpha; Changed: 27.12.2012 OPT; Price: 0.118; Supplier 1: Digi-Key; Supplier Part Number 1: 490-3903-1-ND; Part Status: Discontinued at Digi-Key; RoHS: RoHS Compliant
C1001 C1003 = F0032: Capacitor; Part-Number: 63.0104.1000; Manufacturer: KEMET; Manufacturer Part Number: C0805C104K5RACTU; Designator: C 0.1uF 50V; ID: F0032; Operating Range: -55°C to +125°C; Note: 0.1uF 10% 50V X7R AVX 08055C104KAT2A; Specification: 19.09.2011 MLP; Verification: 05.07.2012 OPT; Value: 0.1uF 50V; Component Type: Standard; ComponentLink1Description: http://www.kemet.com/docfinder?Partnumber=C0805C104K5RACTU; ComponentLink1URL: http://www.kemet.com/docfinder?Partnumber=C0805C104K5RACTU; Status: Active; Availability Date: 15.11.2016 OPT; RoHS compliant: Yes; Flammability: n.a.; Pin Count: 2; Price 100: 0.011; Price 1000: 0.011; Price Date: 02.12.2019 Pro Alpha; Changed: 19.09.2011 MLP; Price: 0.015; Supplier 1: Digi-Key; Supplier Part Number 1: 399-1170-1-ND; Part Status: Active; RoHS: RoHS Compliant
C1004-C1006 = F0002: Capacitor; Part-Number: 63.7000.0120; Manufacturer: AVX Corporation; Manufacturer Part Number: 0805YD106KAT2A; Designator: C 10uF 16V; ID: F0002; Operating Range: -55°C to +85°C; Note: 10uF 10% 16V X5R AVX 0805YD106KAT2A; Specification: 10.11.2011 MLP; Verification: 05.07.2012 OPT; Value: 10uF 16V; Component Type: Standard; ComponentLink1Description: Datasheet; ComponentLink1URL: http://www.murata.com/products/catalog/pdf/c02e.pdf; Status: Active; Availability Date: 15.11.2016 OPT; RoHS compliant: Yes; Flammability: n.a.; ComponentLink2Description: http://datasheets.avx.com/cx5r.pdf; ComponentLink2URL: http://datasheets.avx.com/cx5r.pdf; Pin Count: 2; Price 100: 0.087; Price 1000: 0.068; Price Date: 02.12.2019 Pro Alpha; Changed: 10.11.2011 MLP; Price: 0.062; Supplier 1: Digi-Key; Supplier Part Number 1: 478-5165-1-ND; Part Status: Active; RoHS: RoHS Compliant
C1007 C1008 C1010 C1013 = F0032: Capacitor; Part-Number: 63.0104.1000; Manufacturer: KEMET; Manufacturer Part Number: C0805C104K5RACTU; ID: F0032; Operating Range: -55°C to +125°C; Note: 0.1uF 10% 50V X7R AVX 08055C104KAT2A; Specification: 19.09.2011 MLP; Value: 0.1uF 50V; Verification: 05.07.2012 OPT; Designator: C 0.1uF 50V; Component Type: Standard; ComponentLink1Description: http://www.kemet.com/docfinder?Partnumber=C0805C104K5RACTU; ComponentLink1URL: http://www.kemet.com/docfinder?Partnumber=C0805C104K5RACTU; Status: Active; Availability Date: 15.11.2016 OPT; RoHS compliant: Yes; Flammability: n.a.; Pin Count: 2; Price 100: 0.011; Price 1000: 0.011; Price Date: 02.12.2019 Pro Alpha; Changed: 19.09.2011 MLP; Price: 0.015; Supplier 1: Digi-Key; Supplier Part Number 1: 399-1170-1-ND; Part Status: Active; RoHS: RoHS Compliant
C1009 C1012 = F0101: Capacitor; Part-Number: 63.7000.0150; Manufacturer: Johanson Dielectrics Inc.; Manufacturer Part Number: 6R3R07X225MV4T; Designator: C 2.2uF 6.3V; ID: F0101; Operating Range: -55°C to +85°C; Note: 2.2uF 6.3V 20% X5R Johanson Dielectrics 6R3R07X225MV4T; Specification: 14.11.2014 OPT; Value: 2.2uF 6.3V; Component Type: Standard; ComponentLink1Description: Datasheet; ComponentLink1URL: http://www.mouser.com/ds/2/611/JDI_Tanceram_High-Cap-2013-04-242302.pdf; Pin Count: 2; Price 100: 0.093; Price 1000: 0.074; Price Date: 02.12.2019 Pro Alpha; Changed: 14.11.2014 OPT; Price: 0.123; Availability Date: 15.11.2016 OPT; Flammability: n.a.; RoHS compliant: Yes; Status: Active; ComponentLink2Description: https://www.johansondielectrics.com/downloads/JDI-Tanceram.pdf; ComponentLink2URL: https://www.johansondielectrics.com/downloads/JDI-Tanceram.pdf; Part Status: Active; RoHS: RoHS Compliant; Supplier Part Number 1: 709-1223-1-ND; Supplier 1: Digi-Key
C1011 = F0091: Capacitor; Part-Number: 63.7000.0020; Manufacturer: KEMET; Manufacturer Part Number: C0402C105K9PACTU; Designator: C 1uF 6.3V; ID: F0091; Operating Range: -55°C to +125°C; Note: 1uF X5R 6.3V 10% Taiyo Yuden JMK105BJ105KV-F; Specification: 19.09.2011 MLP; Verification: 05.07.2012 OPT; Value: 1uF 6.3V; Component Type: Standard; Pin Count: 2; Price 100: 0.004; Price 1000: 0.004; Price Date: 02.12.2019 Pro Alpha; Changed: 19.09.2011 MLP; Price: 0.006; Availability Date: 15.11.2016 OPT; Flammability: n.a.; RoHS compliant: Yes; Status: Active; ComponentLink1Description: http://www.kemet.com/docfinder?Partnumber=C0402C105K9PACTU; ComponentLink1URL: http://www.kemet.com/docfinder?Partnumber=C0402C105K9PACTU; Part Status: Active; RoHS: RoHS Compliant; Supplier Part Number 1: 399-4873-1-ND; Supplier 1: Digi-Key
D1000 D1001 = A0053: LED; Part-Number: 00.0000.0000; Manufacturer: Dialight; Manufacturer Part Number: 5988170107F; Designator: LED SMD 0805; ID: A0053; Operating Range: -30°C to +85°C; Note: LED SMD 0805 Green Dialight 598-8170-107F; Value: LED SMD 0805; Specification: 27.12.2012 OPT; Verification: 25.01.2013 MLP; Component Type: Standard; ComponentLink1Description: Datasheet; ComponentLink1URL: http://www.dialight.com/Assets/Brochures_And_Catalogs/Indication/598_SelectorGuide.pdf; Status: Active; Availability Date: 14.11.2016 OPT; RoHS compliant: Yes; Flammability: n.a.; Pin Count: 2; Price 100: 0.092; Price 1000: 0.075; Changed: 27.12.2012 OPT; Price: 0.092; Price Date: 17.09.2014 OPT; Supplier: Digi-Key; Supplier Part Number: 350-2044-1-ND; Part Status: Active; RoHS: RoHS Compliant
IC1000 = K0059: Voltage regulator; Part-Number: 00.0000.0000; Manufacturer: Texas Instruments; Manufacturer Part Number: TLV1117LV33DCYR; Designator: TLV1117LV33DCY; ID: K0059; Operating Range: -40°C to +125°C; Note: Ti TLV1117LV33DCY 3.3V 1A pos. fixed Voltage LDO; Changed: 14.09.2016 OPT; Value: TLV1117LV33DCY; Component Type: Standard; ComponentLink1Description: Datasheet; ComponentLink1URL: http://www.ti.com/lit/ds/symlink/tlv1117lv.pdf; Status: Active; Availability Date: 14.09.2016 OPT; RoHS compliant: Yes; Flammability: n.a.; Pin Count: 4; Price 100: 0.33; Price 1000: 0.265; Price Date: 14.09.2016 OPT; Specification: 14.09.2016 OPT; Price: 0.607; Supplier 1: Digi-Key; Supplier Part Number 1: 296-28778-1-ND; Part Status: Active; RoHS: RoHS Compliant
IC1001 = K0067: Voltage regulator; Part-Number: 00.0000.0000; Manufacturer: Analog Devices; Manufacturer Part Number: 584-ADP2503ACPZ5.0R7; Designator: ADP2503ACPZ-5.0-R7; ID: K0067; Operating Range: -40°C to +125°C; Note: Schaltspannungsregler 5V 600mA, Buck Boost Converter; Changed: 27.10.2022 PEK; Value: ADP2503ACPZ-5.0-R7; Component Type: Standard; ComponentLink1Description: Datasheet; ComponentLink1URL: https://www.mouser.ch/datasheet/2/609/ADP2503_2504-1503443.pdf; Status: Active; Availability Date: 27.10.2022 PEK; RoHS compliant: Yes; Flammability: n.a; Pin Count: 10; Price 100: 3.70; Price 1000: 2.68; Price Date: 27.10.2022 PEK; Specification: 27.10.2022 PEK; Price: 5.04; Supplier 1: Mouser; Supplier Part Number 1: 584-ADP2503ACPZ5.0R7; Part Status: Active; RoHS: RoHS Compliant
IC1002 = K0070: Voltage regulator; Part-Number: 00.0000.0000; Manufacturer: Maxim Integrated; Artikel-Nr.: 61.1836.9600; Preis(CHF): 2.7000; ID: K0070; Operating Range: -40°C to +125°C; Note: Schaltspannungsregler SC70-6 Inverting Charge Pumps with Shutdown MAX1853EXT+T; Changed: 27.10.2022 PEK; Value: MAX1853EXT+T; Component Type: Standard; ComponentLink1Description: Datasheet; ComponentLink1URL: https://www.mouser.ch/datasheet/2/256/MAX1852-MAX1853-1273825.pdf; Status: Active; Availability Date: 27.10.2022 PEK; RoHS compliant: Yes; Flammability: n.a; Pin Count: 6; Price 100: 1.58; Price 1000: 1.11; Price Date: 27.10.2022 PEK; Specification: 27.10.2022 PEK; Price: 2.19; Supplier 1: Mouser; Supplier Part Number 1: 700-MAX1853EXT+T; Manufacturer Part Number: MAX1853EXT+T; Part Status: Active; RoHS: RoHS Compliant
L1000 = M0085: Inductor; Part-Number: 00.0000.0000; Manufacturer: TDK; Manufacturer Part Number: ADL2012-1R5M-T01; Designator: L 1.5uH 0.5A; ID: M0085; Operating Range: -40°C to +125°C; Note: Festinduktivitäten 1.5uH 10% 0.56A CWF2414; Specification: 27.10.2022 PEK; Value: L 1.5uH 0.5A; Component Type: Standard; ComponentLink1Description: Datasheet; ComponentLink1URL: https://product.tdk.com/system/files/dam/doc/product/inductor/inductor/smd/catalog/inductor_automotive_decoupling_adl2012_en.pdf; Status: Active; Availability Date: 27.10.2022 PEK; RoHS compliant: Yes; Flammability: n.a.; Pin Count: 2; Price 100: 0.37; Price 1000: 0.26; Price Date: 27.10.2022 PEK; Changed: 27.10.2022 PEK; Price: 0.62; Supplier 1: Mouser; Supplier Part Number 1: 810-ADL2012-1R5M-T01; Part Status: Active; RoHS: RoHS Compliant
R1000 R1001 = Q0422: Resistor; Part-Number: 00.0000.0000; Manufacturer: Panasonic Electronic Components; Manufacturer Part Number: ERJ-6ENF5600V; Designator: R 560E 1%; ID: Q0422; Operating Range: -55°C to +155°C; Note: Dickfilmwiderstände - SMD 0805 560ohms 1% AEC-Q200; Changed: 15.11.2019 PEK; Value: 560E 1%; Component Type: Standard; ComponentLink1Description: Datasheet; ComponentLink1URL: https://www.mouser.ch/datasheet/2/315/AOA0000C304-1149620.pdf; Status: Active; Availability Date: 15.11.2019 PEK; RoHS compliant: Yes; Flammability: n.a.; Pin Count: 2; Price 100: 0.03; Price 1000: 0.011; Price Date: 15.11.2019 PEK; Specification: 15.11.2019 PEK; Price: 0.098; Supplier: Mouser; Supplier Part Number: 667-ERJ-6ENF5600V; Part Status: Active; RoHS: RoHS Compliant
R1002 = Q0244: as R205 on sheet MCU; Component Type: Standard; ComponentLink1Description: Datasheet; ComponentLink1URL: http://www.mouser.com/ds/2/427/dcrcwe3-109170.pdf; Status: Active; Availability Date: 16.11.2016 OPT; RoHS compliant: Yes; Flammability: n.a.; ComponentLink2Description: http://www.vishay.com/docs/20043/crcwhpe3.pdf; ComponentLink2URL: http://www.vishay.com/docs/20043/crcwhpe3.pdf; Pin Count: 2; Price 100: 0.007; Price 1000: 0.007; Price Date: 02.12.2019 Pro Alpha; Specification: 23.04.2013 OPT; Price: 0.005; Supplier: Digi-Key; Supplier Part Number: 541-0.0TBCT-ND; Part Status: Active; RoHS: RoHS Compliant
R1003 = Q0389: Resistor; Part-Number: 71.1009.1500; Manufacturer: Vishay Dale; Manufacturer Part Number: CRCW060310R0FKEA; Designator: R 10E 1%; ID: Q0389; Operating Range: -55°C to +155°C; Note: 10E 1% 100ppm 1/10W Vishay CRCW060310R0FKEA; Changed: 21.09.2016 OPT; Verification: 26.09.2016 ENP; Value: 10E 1%; Component Type: Standard; ComponentLink1Description: Datasheet; ComponentLink1URL: http://www.vishay.com/docs/20035/dcrcwe3.pdf; Status: Active; Availability Date: 21.09.2016 OPT; RoHS compliant: Yes; Flammability: n.a.; Pin Count: 2; Price 100: 0.026; Price 1000: 0.018; Price Date: 02.12.2019 Pro Alpha; Specification: 21.09.2016 OPT; Price: 0.043; Supplier: Digi-Key; Supplier Part Number: 541-10.0HCT-ND; Part Status: Active; RoHS: RoHS Compliant